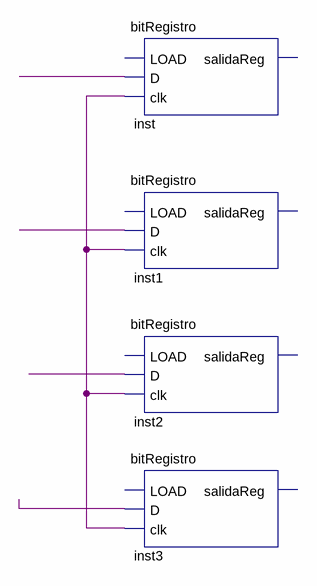
[diagram p0: schematic sheet]
// Quartus schematic Registro4Bits.bdf as structural Verilog: 4 symbols, 0 pins
module Registro4Bits (
);

  wire undriven, undriven_2, undriven_3, undriven_4, undriven_5;

  bitRegistro inst (.D(undriven_2), .clk(undriven));  // open: LOAD, salidaReg
  bitRegistro inst1 (.D(undriven_3), .clk(undriven));  // open: LOAD, salidaReg
  bitRegistro inst2 (.D(undriven_4), .clk(undriven));  // open: LOAD, salidaReg
  bitRegistro inst3 (.D(undriven_5), .clk(undriven));  // open: LOAD, salidaReg
endmodule
